# Altium project Drive-motor V1.0.2.PrjPcb
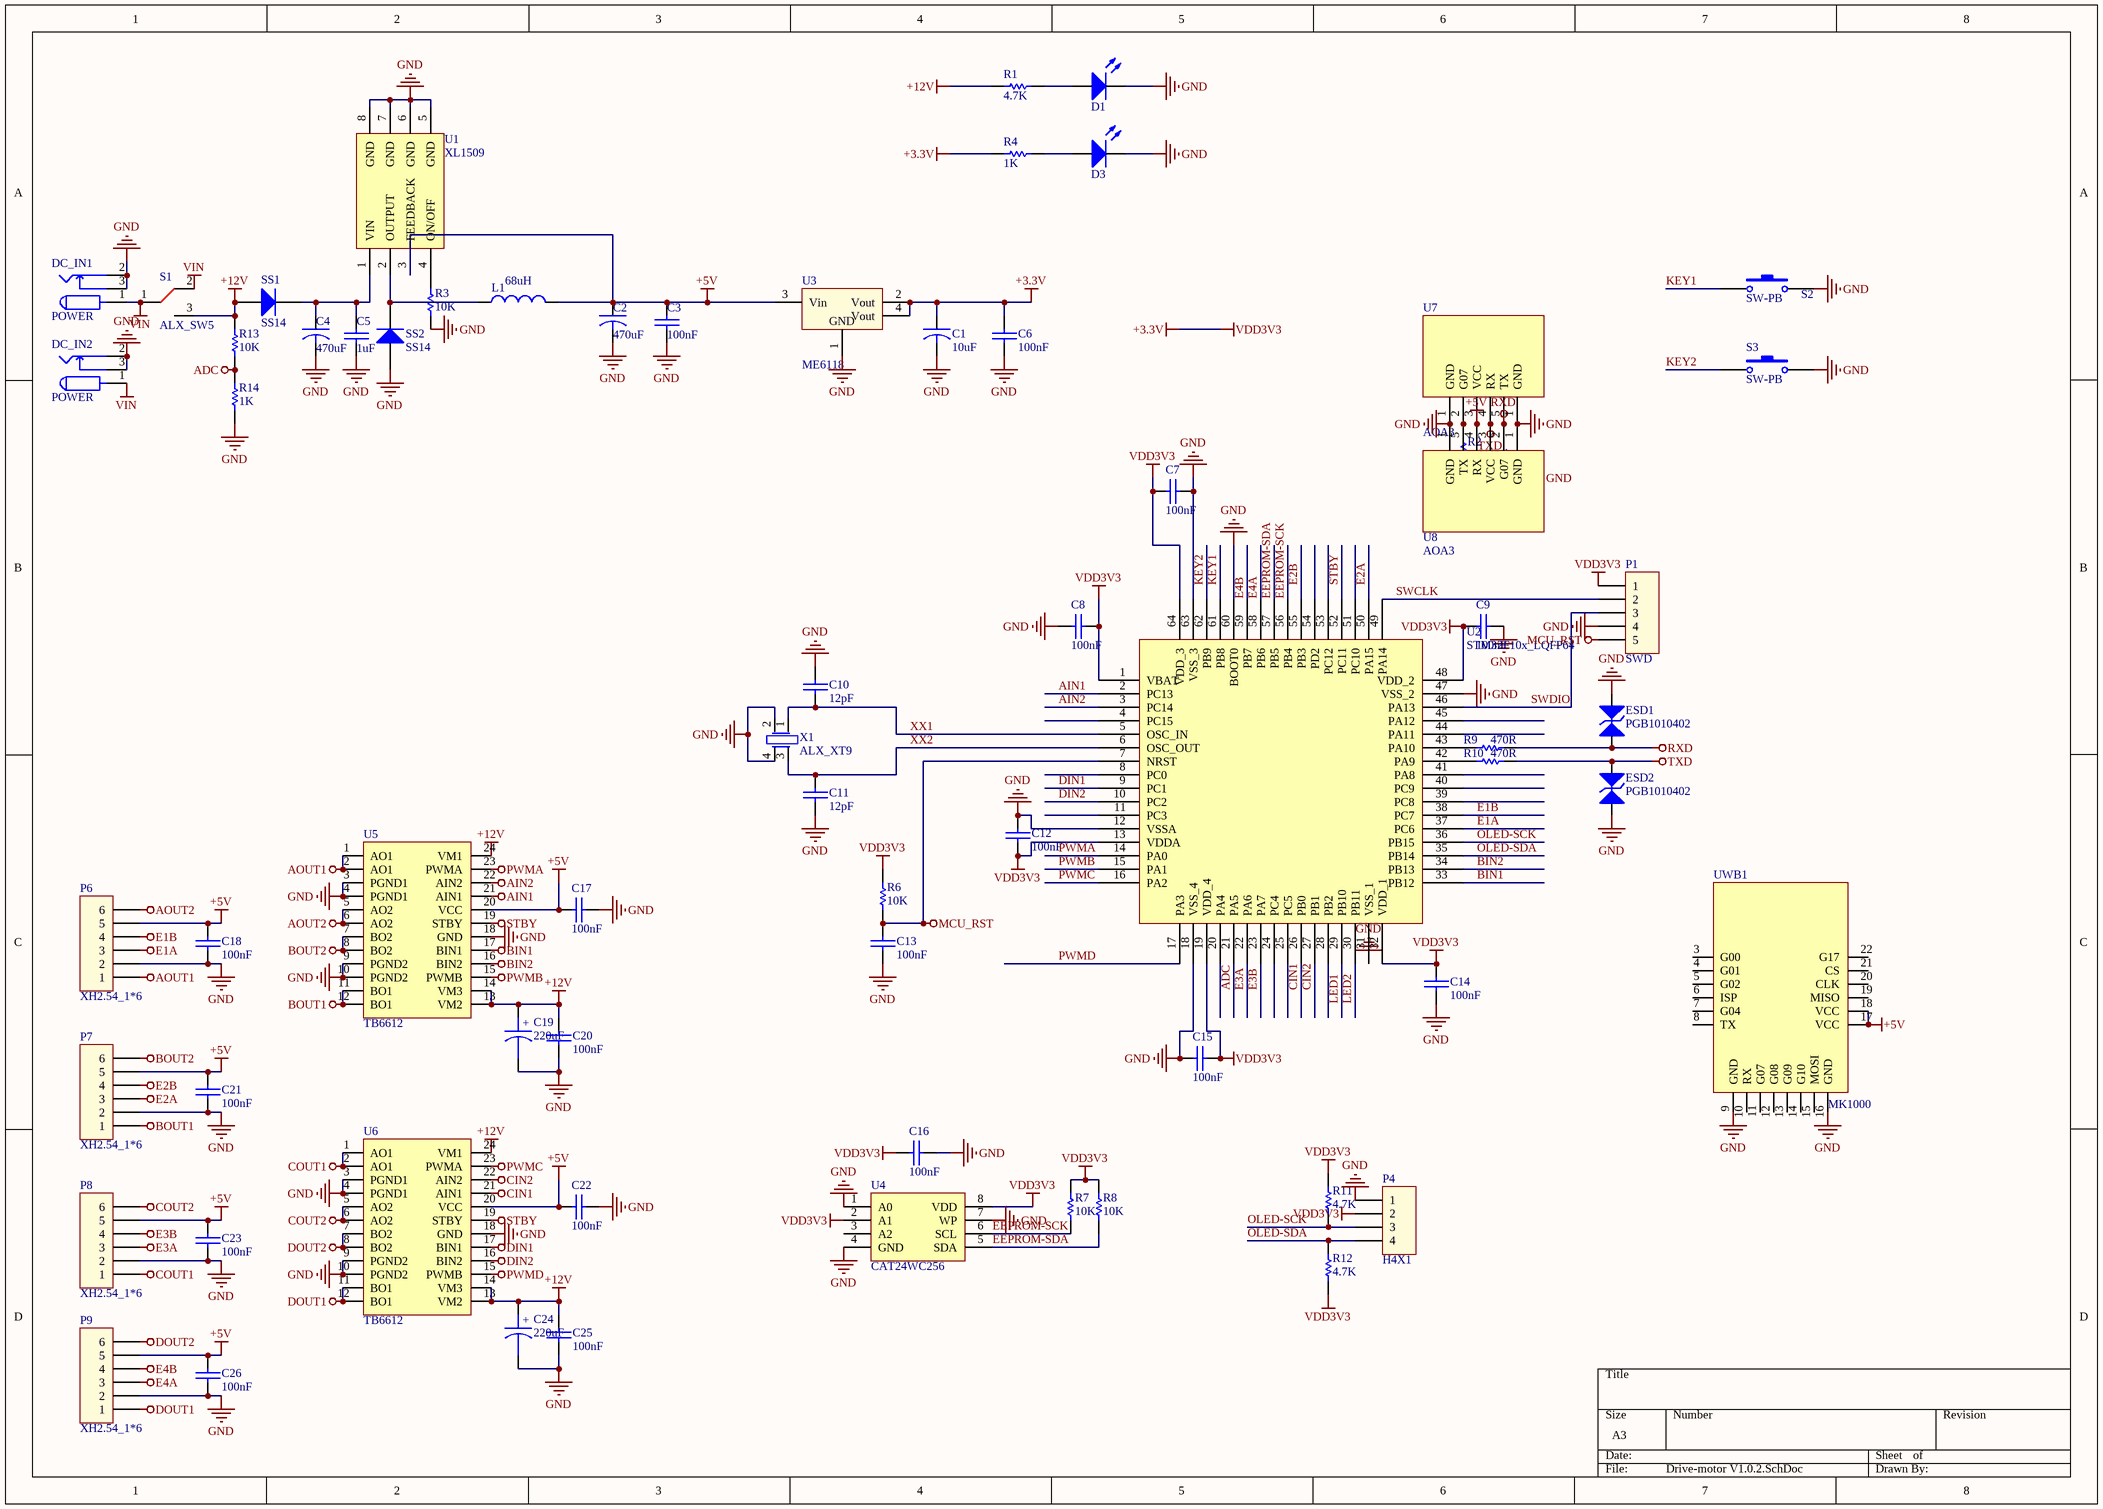
[diagram p0: Drive-motor V1.0.2.SchDoc]
1 sheet, 68 parts. Net scope: global (net labels, ports and power ports of the same name join across sheets).
Board file: Drive-motor V1.0.2.PcbDoc

## Sheet Drive-motor V1.0.2.SchDoc
size A3

### Parts
C1  10uF  [ALX_E]
C2  470uF  [CAP POL [35V]]
C3  100nF  [ALX_0603C]
C4  470uF  [CAP POL [35V]]
C5  1uF  [ALX_0603C]
C6  100nF  [0603C]
C7  100nF  [0603C]
C8  100nF  [0603C]
C9  100nF  [0603C]
C10  12pF  [0603C]
C11  12pF  [0603C]
C12  100nF  [0603C]
C13  100nF  [0603C]
C14  100nF  [0603C]
C15  100nF  [0603C]
C16  100nF  [0603C]
C17  100nF  [0603C]
C18  100nF  [0603C]
C19  Cap Pol  [CAP[1206]]  (value not drawn)
C20  100nF  [0603C]
C21  100nF  [0603C]
C22  100nF  [0603C]
C23  100nF  [0603C]
C24  Cap Pol  [CAP[1206]]  (value not drawn)
C25  100nF  [0603C]
C26  100nF  [0603C]
D1  LED  [LED[0603]]  (value not drawn)
D2  LED  [LED[0603]]  (value not drawn)
D3  LED  [LED[0603]]  (value not drawn)
DC_IN1  POWER  [DC10B]
DC_IN2  POWER  [DC10B]
ESD1  PGB1010402  [ALX_0402A]
ESD2  PGB1010402  [ALX_0402A]
L1  68uH  [Inductor_0650_47UH]
P1  SWD  [H2.54-1X5]
P4  H4X1  [0.96]
P6  XH2.54_1*6  [XH2.54-LI-6P]
P7  XH2.54_1*6  [XH2.54-LI-6P]
P8  XH2.54_1*6  [XH2.54-LI-6P]
P9  XH2.54_1*6  [XH2.54-LI-6P]
R1  4.7K  [ALX_0603A]
R2  1K  [ALX_0603A]
R3  10K  [ALX_0603A]
R4  1K  [ALX_0603A]
R6  10K  [ALX_0603A]
R7  10K  [ALX_0603A]
R8  10K  [ALX_0603A]
R9  470R  [ALX_0603A]
R10  470R  [ALX_0603A]
R11  4.7K  [ALX_0603A]
R12  4.7K  [ALX_0603A]
R13  10K  [ALX_0603A]
R14  1K  [ALX_0603A]
S1  ALX_SW5  [ALX_SW5]
S2  SW-PB  [ALX_Key-4 -6]
S3  SW-PB  [ALX_Key-4 -6]
SS1  SS14  [ALX_SSx4]
SS2  SS14  [ALX_SSx4]
U1  XL1509  [SOP8]
U2  STM32F10x_LQFP64  [LQFP64-10*10]
U3  ME6118  [SOT-223(AMS1117-3.3)]
U4  CAT24WC256  [SO-8]
U5  TB6612  [SSOP24_L]
U6  TB6612  [SSOP24_L]
U7  AOA3  [4ANTA - 3]
U8  AOA3  [4ANTA - 3]
UWB1  MK1000  [MK1000]
X1  ALX_XT9  [ALX_XT-9]

### Nets
+3.3V: C1.1 C6.1 C7.1 C8.2 C9.1 C12.1 C14.2 C15.1 C16.2 P1.1 P4.2 R4.2 R6.2 R7.2 R8.2 R11.2 R12.1 U2.1(VBAT) U2.13(VDDA) U2.19(VDD_4) U2.32(VDD_1) U2.48(VDD_2) U2.64(VDD_3) U3.2(Vout) U3.4(Vout) U4.2(A1) U4.8(VDD)  [also labelled VDD3V3]
+5V: C2.1 C3.1 C17.2 C18.1 C21.1 C22.2 C23.1 C26.1 L1.2 P6.5 P7.5 P8.5 P9.5 U1.3(FEEDBACK) U3.3(Vin) U5.20(VCC) U6.20(VCC) U7.3(VCC) U8.4(RX) UWB1.17(VCC) UWB1.18(VCC)
+12V: C19.1 C20.1 C24.1 C25.1 R1.2 R13.2 S1.3 SS1.1 U5.13(VM2) U5.14(VM3) U5.24(VM1) U6.13(VM2) U6.14(VM3) U6.24(VM1)
ADC: R13.1 R14.2 U2.21(PA5)
AIN1: U2.2(PC13) U5.21(AIN1)
AIN2: U2.3(PC14) U5.22(AIN2)
AOUT1: P6.1 U5.1(AO1) U5.2(AO1)
AOUT2: P6.6 U5.5(AO2) U5.6(AO2)
BIN1: U2.33(PB12) U5.17(BIN1)
BIN2: U2.34(PB13) U5.16(BIN2)
BOUT1: P7.1 U5.11(BO1) U5.12(BO1)
BOUT2: P7.6 U5.7(BO2) U5.8(BO2)
CIN1: U2.26(PB0) U6.21(AIN1)
CIN2: U2.27(PB1) U6.22(AIN2)
COUT1: P8.1 U6.1(AO1) U6.2(AO1)
COUT2: P8.6 U6.5(AO2) U6.6(AO2)
DIN1: U2.9(PC1) U6.17(BIN1)
DIN2: U2.10(PC2) U6.16(BIN2)
DOUT1: P9.1 U6.11(BO1) U6.12(BO1)
DOUT2: P9.6 U6.7(BO2) U6.8(BO2)
E1A: P6.3 U2.37(PC6)
E1B: P6.4 U2.38(PC7)
E2A: P7.3 U2.50(PA15)
E2B: P7.4 U2.55(PB3)
E3A: P8.3 U2.22(PA6)
E3B: P8.4 U2.23(PA7)
E4A: P9.3 U2.58(PB6)
E4B: P9.4 U2.59(PB7)
GND: C1.2 C2.2 C3.2 C4.2 C5.2 C6.2 C7.2 C8.1 C9.2 C10.2 C11.1 C12.2 C13.1 C14.1 C15.2 C16.1 C17.1 C18.2 C19.2 C20.2 C21.2 C22.1 C23.2 C24.2 C25.2 C26.2 D1.2(K) D2.2(K) D3.2(K) DC_IN1.2 DC_IN1.3 DC_IN2.2 DC_IN2.3 ESD1.1(A) ESD2.2(K) P1.4 P4.1 P6.2 P7.2 P8.2 P9.2 R3.1 R14.1 S2.2 S3.2 SS2.1 U1.5(GND) U1.6(GND) U1.7(GND) U1.8(GND) U2.12(VSSA) U2.18(VSS_4) U2.31(VSS_1) U2.47(VSS_2) U2.60(BOOT0) U2.63(VSS_3) U3.1(GND) U4.1(A0) U4.4(GND) U4.7(WP) U5.3(PGND1) U5.4(PGND1) U5.9(PGND2) U5.10(PGND2) U5.18(GND) U6.3(PGND1) U6.4(PGND1) U6.9(PGND2) U6.10(PGND2) U6.18(GND) U7.1(GND) U8.1(GND) UWB1.9(GND) UWB1.16(GND) X1.2(GND) X1.4(GND)
MCU_RST: C13.2 P1.5 R6.1 U2.7(NRST)
PWMA: U2.14(PA0) U5.23(PWMA)
PWMB: U2.15(PA1) U5.15(PWMB)
PWMC: U2.16(PA2) U6.23(PWMA)
PWMD: U2.17(PA3) U6.15(PWMB)
RXD: ESD1.2(K) R9.2 U7.5(TX) U8.2(G07)
STBY: U2.52(PC11) U5.19(STBY) U6.19(STBY)
TXD: ESD2.1(A) R10.2 U7.4(RX) U8.3(VCC)
VIN: DC_IN1.1 DC_IN2.1 S1.1 S1.2
EEPROM-SCK: R7.1 U2.56(PB4) U4.6(SCL)
EEPROM-SDA: R8.1 U2.57(PB5) U4.5(SDA)
KEY1: S2.1 U2.61(PB8)
KEY2: S3.1 U2.62(PB9)
LED1: U2.29(PB10)
LED2: U2.30(PB11)
OLED-SCK: P4.3 R11.1 U2.36(PB15)
OLED-SDA: P4.4 R12.2 U2.35(PB14)
SWCLK: P1.2 U2.49(PA14)
SWDIO: P1.3 U2.46(PA13)
XX1: C10.1 U2.5(OSC_IN) X1.1(OSCO)
XX2: C11.2 U2.6(OSC_OUT) X1.3(OSCI)
NetC4_1: C4.1 C5.1 SS1.2 U1.1(VIN)
NetD1_1: D1.1(A) R1.1
NetD2_1: D2.1(A) R2.2
NetD3_1: D3.1(A) R4.1
NetL1_1: L1.1 SS2.2 U1.2(OUTPUT)
NetR2_1: R2.1 U7.2(G07) U8.5(TX)
NetR3_2: R3.2 U1.4(ON/OFF)
NetR9_1: R9.1 U2.43(PA10)
NetR10_1: R10.1 U2.42(PA9)

Not connected (* = marked no-connect by the designer): U2 4(PC15) 8(PC0) 11(PC3) 20(PA4) 24(PC4) 25(PC5) 28(PB2) 39(PC8) 40(PC9) 41(PA8) 44(PA11) 45(PA12) 51(PC10) 53(PC12) 54(PD2); U4 3(A2); UWB1 3(G00) 4(G01) 5(G02) 6(ISP) 7(G04) 8(TX) 10(RX) 11(G07) 12(G08) 13(G09) 14(G10) 15(MOSI) 19(MISO) 20(CLK) 21(CS) 22(G17)

### Notes on the sheet
- (in symbol Cap Pol) +; 220uF

### Library data of the parts
C1 C2 C4 = ALX_CAPACITOR: Capacitor
C3 C5-C18 C20-C23 C25 C26 = ALX_CAP: Capacitor
DC_IN1 DC_IN2 = POW
ESD1 ESD2 = PGB1010402: Zener Diode
L1 = Inductor
P1 = H5X1
R1 R2 R4 R6-R14 = ALX_RES_1
R3 = ALX_RES
S1 = ALX_SW5: SW
S2 S3 = ALX_SW-PB: Switch
SS1 SS2 = ALX_SS24
U3 = AMS1117-3.3
U4 = FM24C64
U7 U8 = AOA3: AOA2
X1 = ALX_XT9: 4 Pin Header